# EAGLE design BPMLabLineTX (EAGLE 7.5.0)
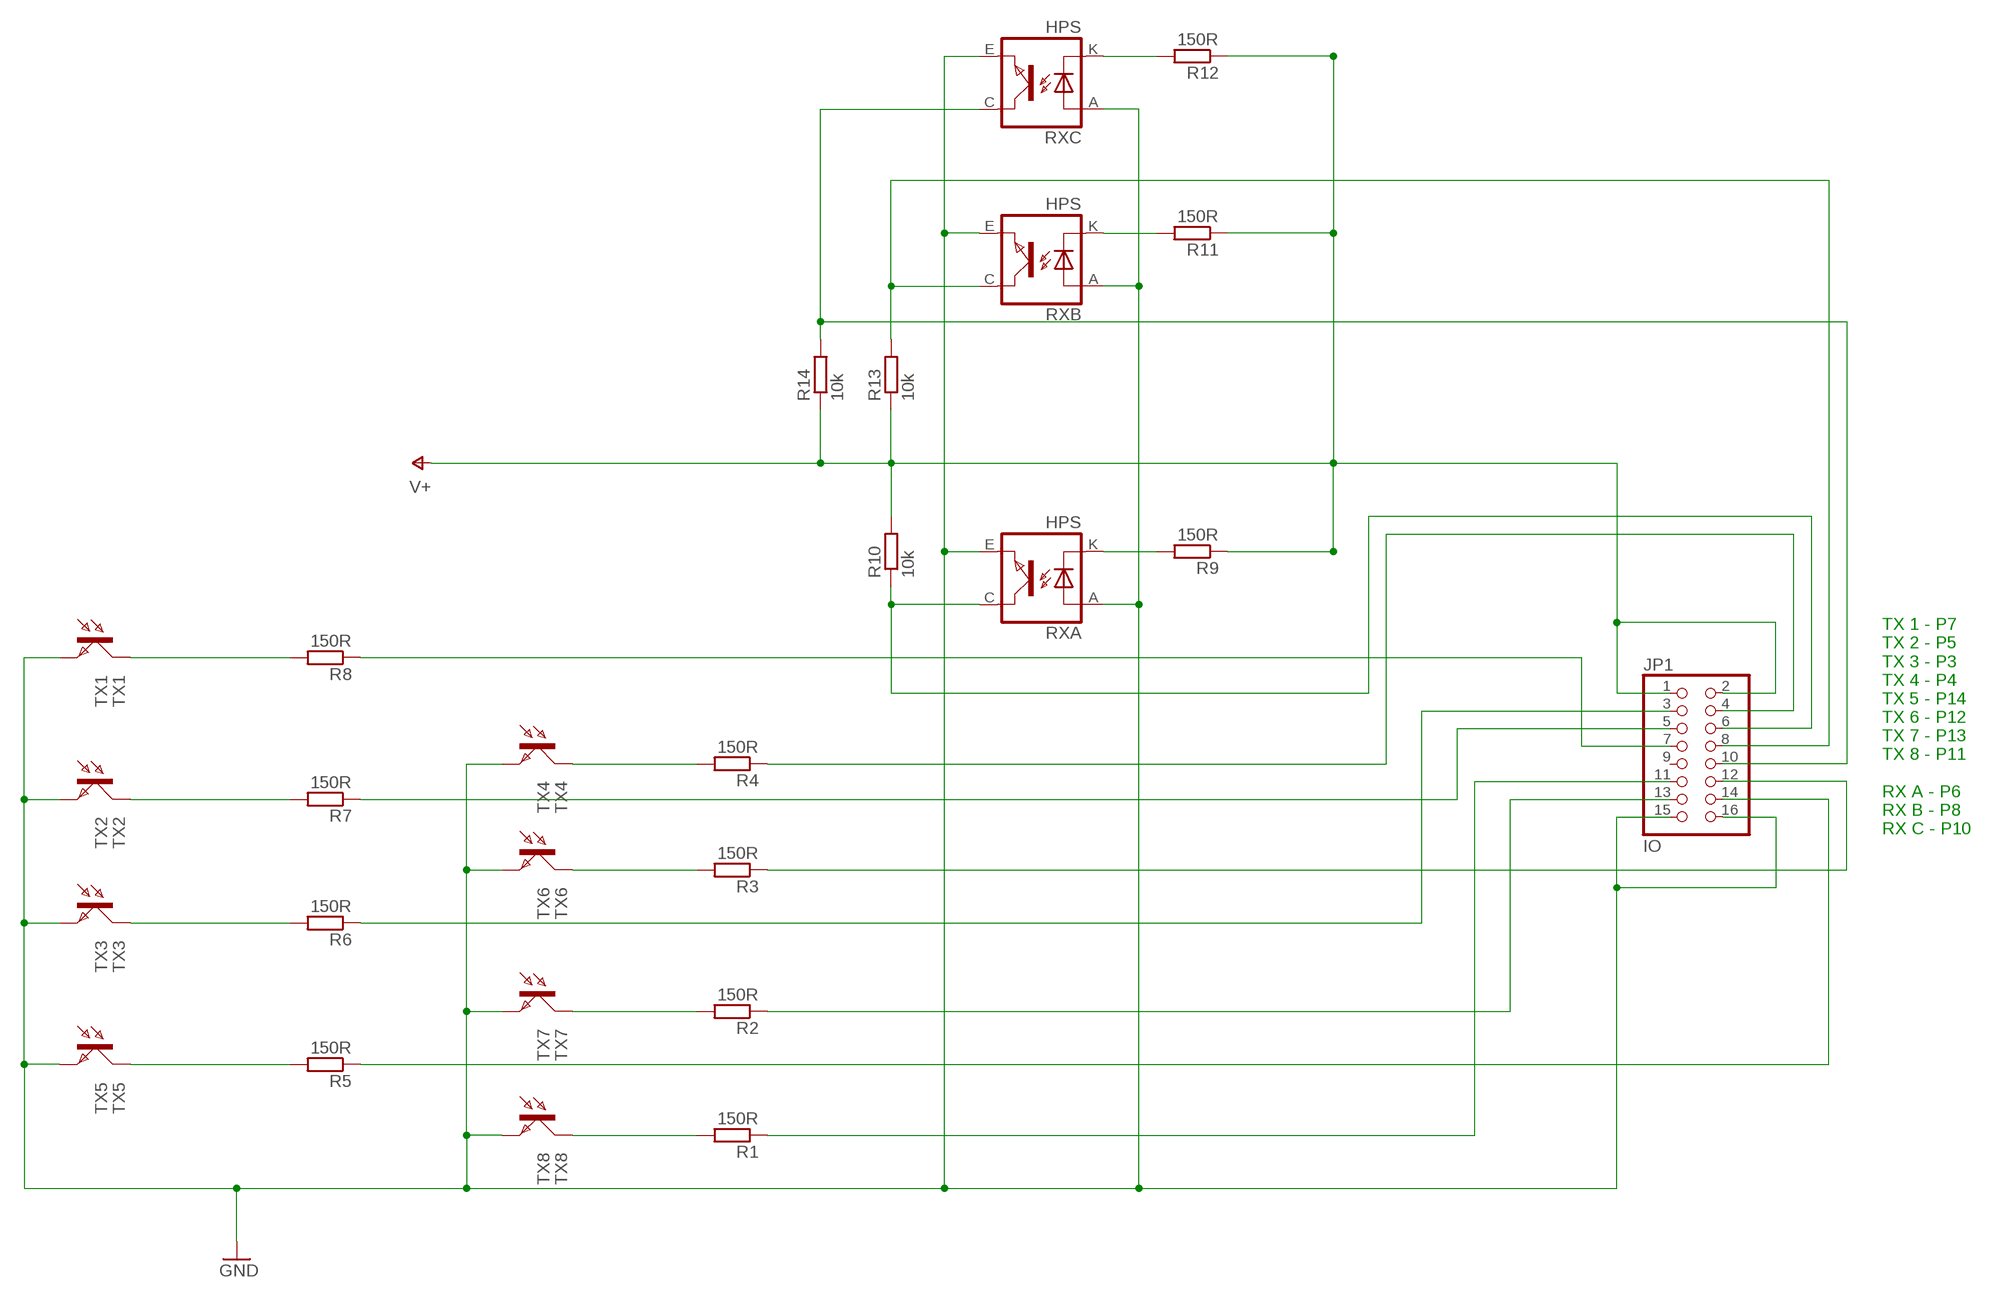
[diagram p0: schematic, sheet 1]

## Parts
JP1  IO  PINHD-2X8  [2X08]
R1  150R  R-EU_M0805  [M0805]
R2  150R  R-EU_M0805  [M0805]
R3  150R  R-EU_M0805  [M0805]
R4  150R  R-EU_M0805  [M0805]
R5  150R  R-EU_M0805  [M0805]
R6  150R  R-EU_M0805  [M0805]
R7  150R  R-EU_M0805  [M0805]
R8  150R  R-EU_M0805  [M0805]
R9  150R  R-EU_M0805  [M0805]
R10  10k  R-EU_M0805  [M0805]
R11  150R  R-EU_M0805  [M0805]
R12  150R  R-EU_M0805  [M0805]
R13  10k  R-EU_M0805  [M0805]
R14  10k  R-EU_M0805  [M0805]
RXA  HPS  TCRT5000  [TCRT5000]
RXB  HPS  TCRT5000  [TCRT5000]
RXC  HPS  TCRT5000  [TCRT5000]
TX1  TX1  BPX81  [BPX81]
TX2  TX2  BPX81  [BPX81]
TX3  TX3  BPX81  [BPX81]
TX4  TX4  BPX81  [BPX81]
TX5  TX5  BPX81  [BPX81]
TX6  TX6  BPX81  [BPX81]
TX7  TX7  BPX81  [BPX81]
TX8  TX8  BPX81  [BPX81]

## Nets
GND: JP1.15 JP1.16 RXA.A(ANODE) RXA.E(EMITTER) RXB.A(ANODE) RXB.E(EMITTER) RXC.A(ANODE) RXC.E(EMITTER) TX1.E TX2.E TX3.E TX4.E TX5.E TX6.E TX7.E TX8.E
N$1: JP1.4 R4.1
N$2: JP1.12 R3.1
N$3: JP1.13 R2.1
N$4: JP1.11 R1.1
N$5: JP1.7 R8.1
N$6: JP1.5 R7.1
N$7: JP1.3 R6.1
N$8: JP1.14 R5.1
N$9: JP1.6 R10.1 RXA.C(COLLECTOR)
N$10: R9.2 RXA.K(CATHODE)
N$11: R8.2 TX1.C
N$12: R12.2 RXC.K(CATHODE)
N$13: R11.2 RXB.K(CATHODE)
N$14: R7.2 TX2.C
N$15: R6.2 TX3.C
N$16: JP1.8 R13.2 RXB.C(COLLECTOR)
N$17: JP1.10 R14.2 RXC.C(COLLECTOR)
N$18: R5.2 TX5.C
N$19: R1.2 TX8.C
N$20: R2.2 TX7.C
N$21: R3.2 TX6.C
N$22: R4.2 TX4.C
V+: JP1.1 JP1.2 R9.1 R10.2 R11.1 R12.1 R13.1 R14.1
Unconnected: JP1.9

## Notes on the sheet
- TX 1 - P7
  TX 2 - P5
  TX 3 - P3
  TX 4 - P4
  TX 5 - P14
  TX 6 - P12
  TX 7 - P13
  TX 8 - P11
  
  RX A - P6
  RX B - P8
  RX C - P10

## Library data of the parts
JP1 = pinhead:PINHD-2X8: PIN HEADER
R1-R14 = resistor:R-EU_: RESISTOR, European symbol
RXA RXB RXC = tcrt5000:TCRT5000
TX1-TX8 = opto-trans-siemens:BPX81: PHOTO TRANSISTOR; OC_FARNELL: unknown; OC_NEWARK: unknown

## Board
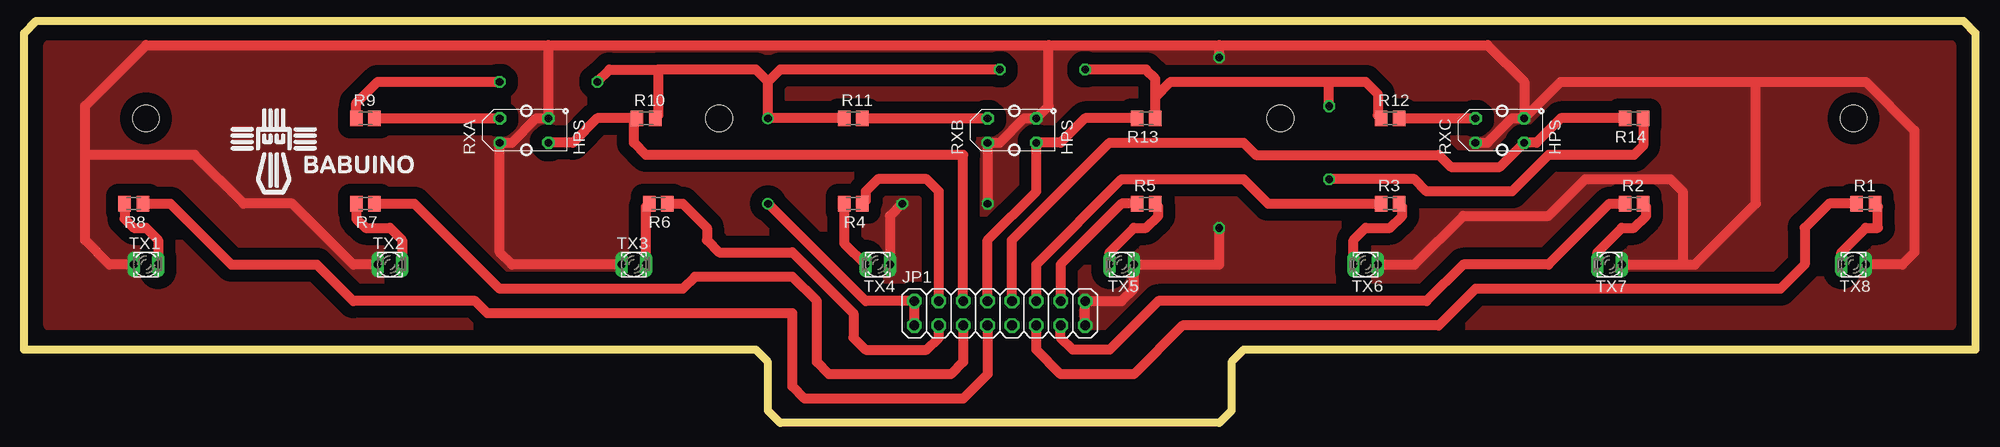
[diagram p1: board, top side]
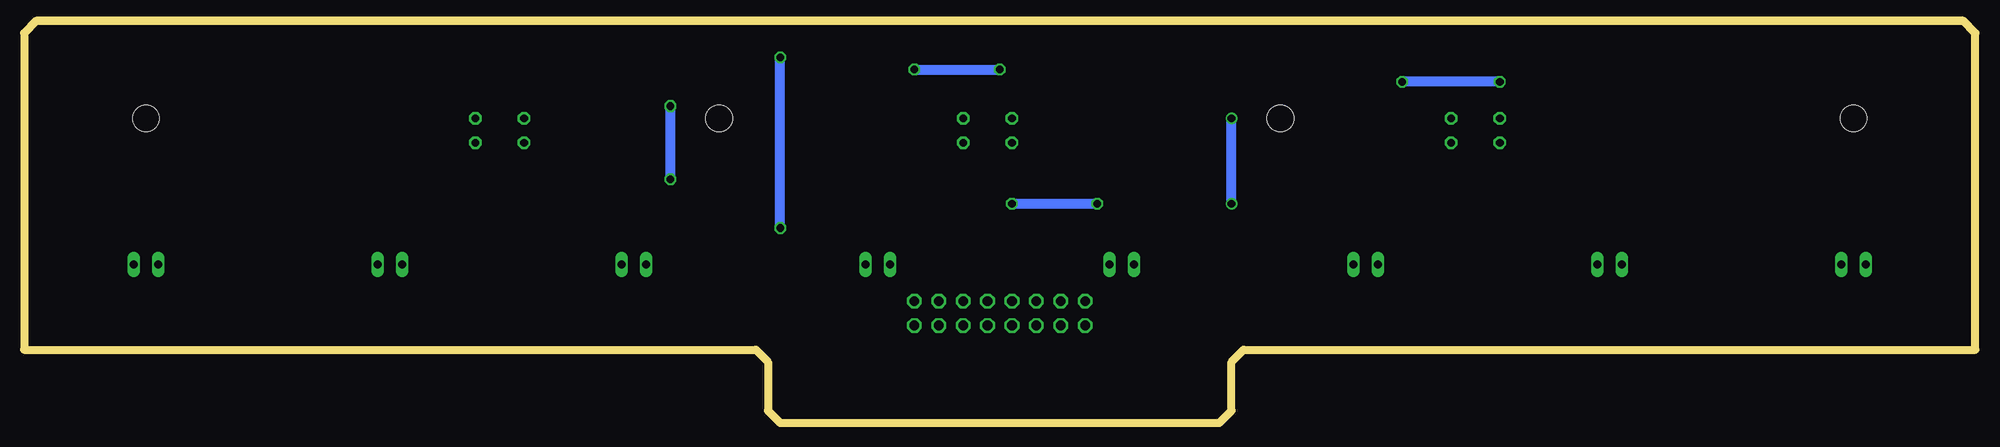
[diagram p2: board, bottom side, seen from below]

Size 203.2 x 41.58 mm. Coordinates in mm from the lower left corner, seen from the top.
Outline: 0,7.62 76.2,7.62 77.47,6.35 77.47,1.27 78.74,0 124.46,0 125.73,1.27 125.73,6.35 127,7.62 203.2,7.62 203.2,40.64 202.26,41.58 0.94,41.58 0,40.64 0,7.62
Copper layers (1*16): Top 0.035mm / dielectric 1.5mm / Bottom 0.035mm
Design rules "default *": minimum track width 40mil, minimum drill 30mil, track to track 8mil, track to pad 8mil, pad to pad 8mil, via to via 8mil, smd to smd 8mil, copper to edge 40mil, drill to drill 8mil, minimum pad ring 10mil, minimum via ring 8mil, stop-mask expansion 4mil, vias tented up to drill 0mil, thermal gap 0mil
Holes 2.8 mm at 72.39,31.75 130.81,31.75 190.5,31.75 12.7,31.75
Milling: 14 lines

### Footprints (pad centres in the part's own frame; a part is rotated, then mirrored left to right if it is on the bottom)
2X08 = drill 1.016 octagon: 1 -8.89,-1.27; 2 -8.89,1.27; 3 -6.35,-1.27; 4 -6.35,1.27; 5 -3.81,-1.27; 6 -3.81,1.27; 7 -1.27,-1.27; 8 -1.27,1.27; 9 1.27,-1.27; 10 1.27,1.27; 11 3.81,-1.27; 12 3.81,1.27; 13 6.35,-1.27; 14 6.35,1.27; 15 8.89,-1.27; 16 8.89,1.27
M0805 = smd 1.3 x 1.6: 1 -0.95,0; 2 0.95,0
TCRT5000 = drill 0.8 octagon: A -2.54,-1.27; C 2.54,-1.27; E 2.54,1.27; K -2.54,1.27
BPX81 = drill 0.813 long: C 1.27,0; E -1.27,0

### Placement (x,y rotation side)
JP1  101.6,11.43 0 top
R1  191.77,22.86 0 top
R2  167.64,22.86 0 top
R3  142.24,22.86 0 top
R4  86.36,22.86 180 top
R5  116.84,22.86 0 top
R6  66.04,22.86 180 top
R7  35.56,22.86 180 top
R8  11.43,22.86 180 top
R9  35.56,31.75 0 top
R10  64.77,31.75 0 top
R11  86.36,31.75 0 top
R12  142.24,31.75 0 top
R13  116.84,31.75 180 top
R14  167.64,31.75 180 top
RXA  52.07,30.48 0 top
RXB  102.87,30.48 0 top
RXC  153.67,30.48 0 top
TX1  12.7,16.51 0 top
TX2  38.1,16.51 0 top
TX3  63.5,16.51 0 top
TX4  88.9,16.51 180 top
TX5  114.3,16.51 180 top
TX6  139.7,16.51 180 top
TX7  165.1,16.51 180 top
TX8  190.5,16.51 180 top

### Tracks (layer width: path | path; a pad name or v marks a point on that pad's centre or on a via)
GND  (via drill 0.8)
  Top 1.016: RXC.A 152.4,29.21 154.94,31.75 RXC.E | JP1.15 JP1.16 114.3,12.7 115.57,13.97 TX5.E 124.46,16.51 v124.46,20.32 | RXC.E 160.02,35.56 180.34,35.56 | 180.34,35.56 191.77,35.56 196.85,30.48 196.85,17.78 195.58,16.51 TX8.E | TX7.E 172.72,16.51 | 172.72,16.51 173.99,16.51 180.34,22.86 180.34,35.56 | TX6.E 144.78,16.51 149.86,21.59 158.75,21.59 162.56,25.4 171.45,25.4 172.72,24.13 172.72,16.51 | 106.68,39.37 106.68,33.02 RXB.E 104.14,31.75 101.6,29.21 RXB.A v100.33,22.86 | 106.68,39.37 124.46,39.37 | 124.46,39.37 152.4,39.37 156.21,35.56 RXC.E | v91.44,22.86 90.17,21.59 TX4.E | 54.61,39.37 RXA.E 53.34,31.75 50.8,29.21 RXA.A 49.53,17.78 50.8,16.51 TX3.E | 54.61,39.37 106.68,39.37 | TX1.E 8.89,16.51 6.35,19.05 6.35,27.94 | 6.35,27.94 6.35,33.02 12.7,39.37 54.61,39.37 | TX2.E 34.29,16.51 27.94,22.86 22.86,22.86 17.78,27.94 6.35,27.94 | v124.46,38.1 124.46,39.37
  Bottom 1.016: v100.33,22.86 v91.44,22.86 | v124.46,20.32 v124.46,38.1
  pour Top (isolate 1.27): 2.54,39.37 200.66,39.37 200.66,10.16 2.54,10.16
N$1
  Top 1.016: JP1.4 95.25,24.13 93.98,25.4 88.9,25.4 87.63,24.13 87.63,23.18 R4.1
N$2
  Top 1.016: JP1.12 105.41,16.51 114.3,25.4 127,25.4 129.54,22.86 R3.1
N$3
  Top 1.016: JP1.13 107.95,8.89 109.22,7.62 113.03,7.62 118.11,12.7 146.05,12.7 149.86,16.51 158.75,16.51 165.1,22.86 R2.1
N$4
  Top 1.016: JP1.11 105.41,7.62 107.95,5.08 115.57,5.08 120.65,10.16 147.32,10.16 151.13,13.97 182.88,13.97 185.42,16.51 185.42,20.32 187.96,22.86 R1.1
N$5
  Top 1.016: R8.1 15.24,22.86 21.59,16.51 30.48,16.51 34.29,12.7 46.99,12.7 48.26,11.43 80.01,11.43 80.01,3.81 81.28,2.54 97.79,2.54 100.33,5.08 JP1.7
N$6
  Top 1.016: R7.1 40.64,22.86 49.53,13.97 68.58,13.97 69.85,15.24 80.01,15.24 82.55,12.7 82.55,6.35 83.82,5.08 96.52,5.08 97.79,6.35 JP1.5
N$7
  Top 1.016: R6.1 68.58,22.86 71.12,20.32 71.12,19.05 72.39,17.78 80.01,17.78 86.36,11.43 86.36,8.89 87.63,7.62 93.98,7.62 95.25,8.89 JP1.3
N$8
  Top 1.016: R5.1 114.3,22.86 107.95,16.51 JP1.14
N$9
  Top 1.016: RXA.C 57.15,29.21 59.69,31.75 R10.1 63.5,31.43 63.5,29.21 64.77,27.94 97.79,27.94 JP1.6
N$10
  Top 1.016: R9.2 RXA.K
N$11
  Top 1.016: R8.2 10.48,21.27 11.43,20.32 12.7,20.32 13.97,19.05 TX1.C
N$12
  Top 1.016: R12.2 RXC.K
N$13
  Top 1.016: R11.2 RXB.K
N$14
  Top 1.016: R7.2 34.61,21.27 35.56,20.32 38.1,20.32 39.37,19.05 TX2.C
N$15
  Top 1.016: TX3.C 64.77,22.54 R6.2
N$16
  Top 1.016: R13.2 110.49,31.75 107.95,29.21 RXB.C 105.41,24.13 100.33,19.05 JP1.8
N$17
  Top 1.016: R14.2 160.02,31.75 157.48,29.21 RXC.C 153.67,26.67 148.59,26.67 147.32,27.94 128.27,27.94 127,29.21 113.03,29.21 102.87,19.05 JP1.10
N$18
  Top 1.016: TX5.C 113.03,17.78 115.57,20.32 116.84,20.32 118.11,21.59 118.11,22.54 R5.2
N$19
  Top 1.016: TX8.C 189.23,17.78 191.77,20.32 193.04,20.32 193.04,22.54 R1.2
N$20
  Top 1.016: TX7.C 163.83,17.78 166.37,20.32 167.64,20.32 168.91,21.59 168.91,22.54 R2.2
N$21
  Top 1.016: TX6.C 138.43,19.05 139.7,20.32 142.24,20.32 143.51,21.59 143.51,22.54 R3.2
N$22
  Top 1.016: R4.2 85.41,18.73 TX4.C
V+  (via drill 0.8)
  Top 1.016: JP1.1 JP1.2 87.63,12.7 v77.47,22.86 | R11.1 v77.47,31.75 77.47,35.56 | 77.47,35.56 76.2,36.83 66.04,36.83 | 66.04,36.83 66.04,32.07 R10.2 | R9.1 34.61,33.34 36.83,35.56 v49.53,35.56 | v59.69,35.56 60.96,36.83 66.04,36.83 | 135.89,35.56 119.38,35.56 117.79,33.97 R13.1 117.79,35.88 116.84,36.83 v110.49,36.83 | 135.89,35.56 139.7,35.56 140.97,34.29 140.97,32.07 R12.1 | R14.1 168.59,28.89 167.64,27.94 158.75,27.94 154.94,24.13 146.05,24.13 144.78,25.4 v135.89,25.4 | v135.89,33.02 135.89,35.56 | v101.6,36.83 78.74,36.83 77.47,35.56
  Bottom 1.016: v77.47,22.86 v77.47,31.75 | v49.53,35.56 v59.69,35.56 | v135.89,25.4 v135.89,33.02 | v110.49,36.83 v101.6,36.83